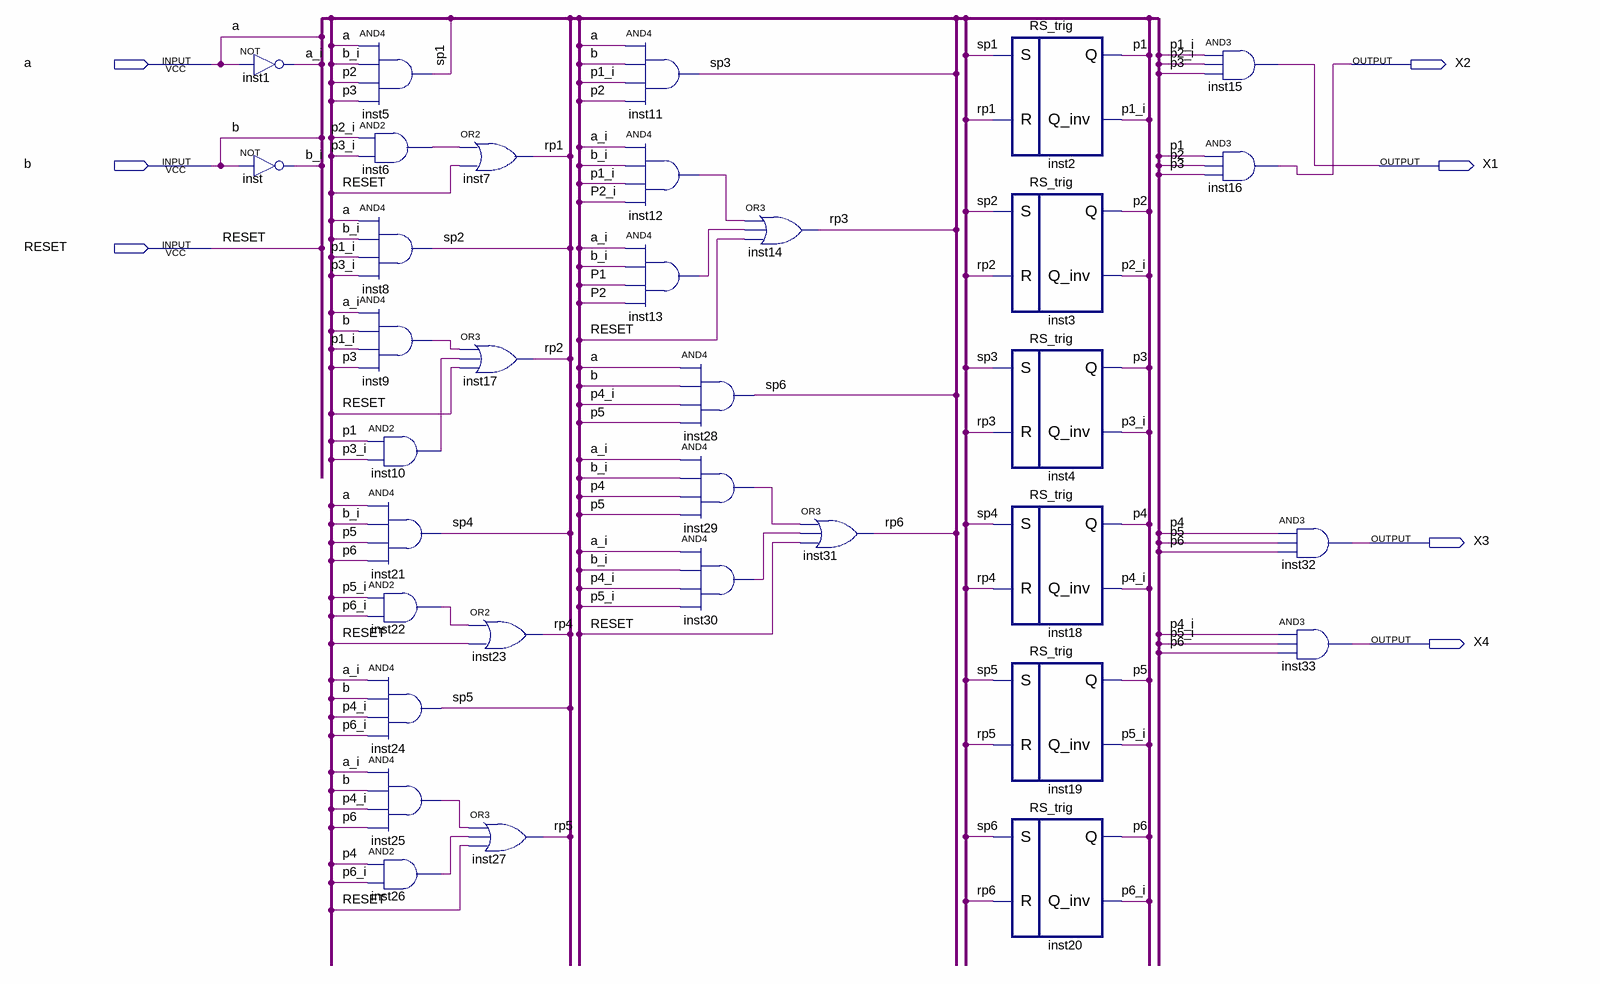
[diagram p0: schematic sheet]
// Quartus schematic lab_8_2_.bdf as structural Verilog: 34 symbols, 7 pins
module lab_8_2_ (
  input  a,
  input  b,
  input  RESET,
  output X2,
  output X1,
  output X3,
  output X4
);

  wire a_i, b_i, inst6_out, inst9_out, inst10_out, inst12_out, inst13_out, inst22_out, inst25_out,
       inst26_out, inst29_out, inst30_out, p1, p1_i, p2, p2_i, p3, p3_i, p4, p4_i, p5, p5_i, p6, p6_i, rp1,
       rp2, rp3, rp4, rp5, rp6, sp1, sp2, sp3, sp4, sp5, sp6;

  not inst1 (a_i, a);
  not inst (b_i, b);
  and inst5 (sp1, a, b_i, p2, p3);
  and inst6 (inst6_out, p2_i, p3_i);
  and inst8 (sp2, a, b_i, p1_i, p3_i);
  and inst9 (inst9_out, a_i, b, p1_i, p3);
  and inst10 (inst10_out, p1, p3_i);
  and inst21 (sp4, a, b_i, p5, p6);
  and inst22 (inst22_out, p5_i, p6_i);
  and inst24 (sp5, a_i, b, p4_i, p6_i);
  and inst25 (inst25_out, a_i, b, p4_i, p6);
  and inst26 (inst26_out, p4, p6_i);
  or inst7 (rp1, inst6_out, RESET);
  or inst17 (rp2, inst9_out, inst10_out, RESET);
  or inst23 (rp4, inst22_out, RESET);
  or inst27 (rp5, inst25_out, inst26_out, RESET);
  and inst11 (sp3, a, b, p1_i, p2);
  and inst12 (inst12_out, a_i, b_i, p1_i, p2_i);
  and inst13 (inst13_out, a_i, b_i, p1, p2);
  or inst14 (rp3, inst12_out, inst13_out, RESET);
  and inst28 (sp6, a, b, p4_i, p5);
  and inst29 (inst29_out, a_i, b_i, p4, p5);
  and inst30 (inst30_out, a_i, b_i, p4_i, p5_i);
  or inst31 (rp6, inst29_out, inst30_out, RESET);
  RS_trig inst2 (.R(rp1), .S(sp1), .Q_inv(p1_i), .Q(p1));
  RS_trig inst3 (.R(rp2), .S(sp2), .Q_inv(p2_i), .Q(p2));
  RS_trig inst4 (.R(rp3), .S(sp3), .Q_inv(p3_i), .Q(p3));
  RS_trig inst18 (.R(rp4), .S(sp4), .Q_inv(p4_i), .Q(p4));
  RS_trig inst19 (.R(rp5), .S(sp5), .Q_inv(p5_i), .Q(p5));
  RS_trig inst20 (.R(rp6), .S(sp6), .Q_inv(p6_i), .Q(p6));
  and inst15 (X1, p1_i, p2_i, p3);
  and inst16 (X2, p1, p2, p3);
  and inst32 (X3, p4, p5, p6);
  and inst33 (X4, p4_i, p5_i, p6);
endmodule
